# EAGLE design Base (EAGLE 9.6.2)
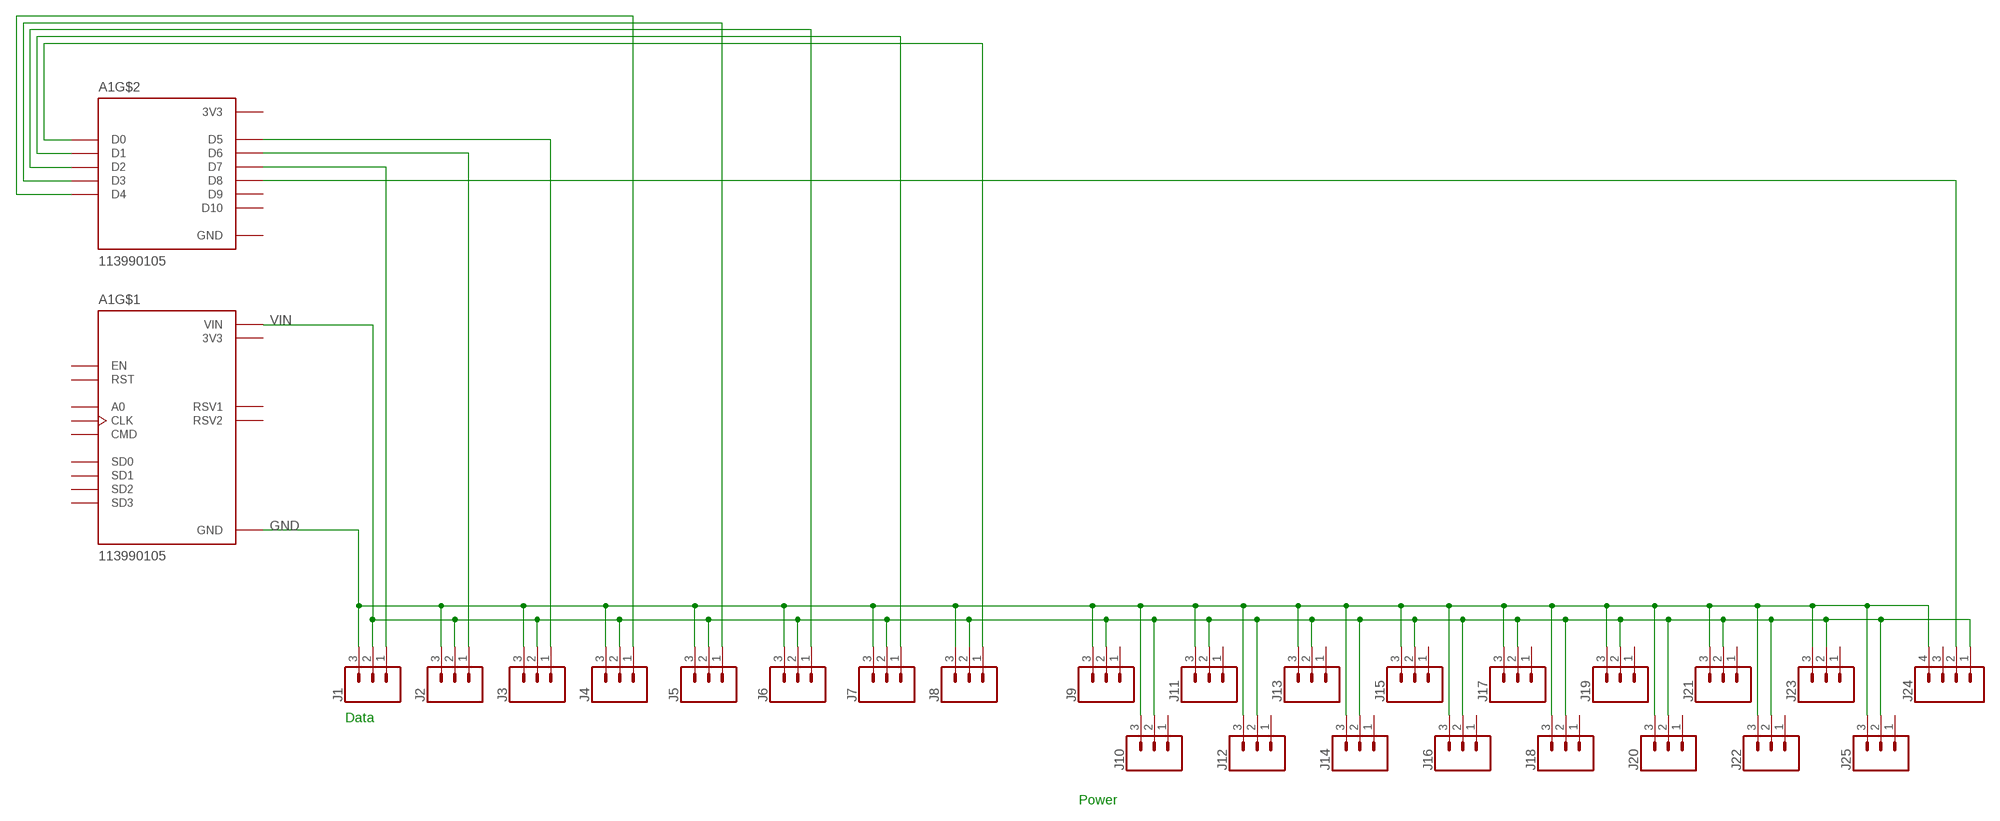
[diagram p0: schematic, sheet 1]

## Parts
A1  113990105  [SEEED_113990105]
J1  CONN_03  [1X03]
J2  CONN_03  [1X03]
J3  CONN_03  [1X03]
J4  CONN_03  [1X03]
J5  CONN_03  [1X03]
J6  CONN_03  [1X03]
J7  CONN_03  [1X03]
J8  CONN_03  [1X03]
J9  CONN_03  [1X03]
J10  CONN_03  [1X03]
J11  CONN_03  [1X03]
J12  CONN_03  [1X03]
J13  CONN_03  [1X03]
J14  CONN_03  [1X03]
J15  CONN_03  [1X03]
J16  CONN_03  [1X03]
J17  CONN_03  [1X03]
J18  CONN_03  [1X03]
J19  CONN_03  [1X03]
J20  CONN_03  [1X03]
J21  CONN_03  [1X03]
J22  CONN_03  [1X03]
J23  CONN_03  [1X03]
J24  CONN_04  [1X04]
J25  CONN_03  [1X03]

## Nets
GND: A1.J1_10(GND) A1.J1_14(GND) J1.3 J2.3 J3.3 J4.3 J5.3 J6.3 J7.3 J8.3 J9.3 J10.3 J11.3 J12.3 J13.3 J14.3 J15.3 J16.3 J17.3 J18.3 J19.3 J20.3 J21.3 J22.3 J23.3 J24.4 J25.3
N$1: A1.J2_10(D7) J1.1
N$2: A1.J2_9(D6) J2.1
N$3: A1.J2_8(D5) J3.1
N$4: A1.J2_5(D4) J4.1
N$5: A1.J2_4(D3) J5.1
N$6: A1.J2_3(D2) J6.1
N$7: A1.J2_2(D1) J7.1
N$8: A1.J2_1(D0) J8.1
N$11: A1.J2_11(D8) J24.2
VIN: A1.J1_15(VIN) J1.2 J2.2 J3.2 J4.2 J5.2 J6.2 J7.2 J8.2 J9.2 J10.2 J11.2 J12.2 J13.2 J14.2 J15.2 J16.2 J17.2 J18.2 J19.2 J20.2 J21.2 J22.2 J23.2 J24.1 J25.2
Unconnected: A1.J1_1(A0) A1.J1_2(RSV1) A1.J1_3(RSV2) A1.J1_4(SD3) A1.J1_5(SD2) A1.J1_6(SD1) A1.J1_7(CMD) A1.J1_8(SD0) A1.J1_9(CLK) A1.J1_12(EN) A1.J1_13(RST) A1.J2_12(D9) A1.J2_13(D10) J9.1 J10.1 J11.1 J12.1 J13.1 J14.1 J15.1 J16.1 J17.1 J18.1 J19.1 J20.1 J21.1 J22.1 J23.1 J24.3 J25.1

## Notes on the sheet
- Data
- Power

## Power pins joined to a net without a drawn wire
3V3: A1.J1_11(3V3) A1.J2_6(3V3) A1.J2_15(3V3)
GND: A1.J2_7(GND) A1.J2_14(GND)

## Library data of the parts
A1 = 113990105:113990105: NodeMCU v2 - Lua based ESP8266 development kit; AVAILABILITY: Unavailable; DESCRIPTION: An open-source firmware and development kit that helps you to Prototype your IOT product within a few Lua script lines; MF: Seeed Technology; MP: NodeMCU v2; PACKAGE: None; PRICE: None
J1-J23 J25 = SparkFun-Connectors:CONN_03: Multi connection point. Often used as Generic Header-pin footprint for 0.1 inch spaced/style header connections On any of the 0.1 inch spaced packages, you can populate with these: Break Away Headers - Straight <https://www.sparkfun.com/products/116> (PRT-00116) Break Away Male Headers - Right Angle <https://www.sparkfun.com/products/553> (PRT-00553) Female Headers <https://www.sparkfun.com/products/115> (PRT-00115) Break Away Headers - Machine Pin <https://www.sparkfun.com/products/117> (PRT-00117) Break Away Female Headers - Swiss Machine Pin <https://www.sparkfun.com/products/743> (PRT-00743) Stackable Header - 3 Pin (Female, 0.1") <https://www.sparkfun.com/products/13875> (PRT-13875) For SCREWTERMINALS and SPRING TERMINALS visit here: Screw Terimnals on SparkFun.com <https://www.sparkfun.com/search/results?term=Screw+Terminals> (5mm/3.5mm/2.54mm spacing) This device is also useful as a general connection point to wire up your design to another part of your project. Our various solder wires solder well into these plated through hole pads. Hook-Up Wire - Assortment (Stranded, 22 AWG) <https://www.sparkfun.com/products/11375> (PRT-11375) Hook-Up Wire - Assortment (Solid Core, 22 AWG) <https://www.sparkfun.com/products/11367> (PRT-11367) View the entire wire category on our website here <https://www.sparkfun.com/categories/141> Special notes: Molex polarized connector foot print use with SKU : PRT-08232 with associated crimp pins and housings.
J24 = SparkFun-Connectors:CONN_04: Multi connection point. Often used as Generic Header-pin footprint for 0.1 inch spaced/style header connections On any of the 0.1 inch spaced packages, you can populate with these: Break Away Headers - Straight <https://www.sparkfun.com/products/116> (PRT-00116) Break Away Male Headers - Right Angle <https://www.sparkfun.com/products/553> (PRT-00553) Female Headers <https://www.sparkfun.com/products/115> (PRT-00115) Break Away Headers - Machine Pin <https://www.sparkfun.com/products/117> (PRT-00117) Break Away Female Headers - Swiss Machine Pin <https://www.sparkfun.com/products/743> (PRT-00743) For SCREWTERMINALS and SPRING TERMINALS visit here: Screw Terimnals on SparkFun.com <https://www.sparkfun.com/search/results?term=Screw+Terminals> (5mm/3.5mm/2.54mm spacing) This device is also useful as a general connection point to wire up your design to another part of your project. Our various solder wires solder well into these plated through hole pads. Hook-Up Wire - Assortment (Stranded, 22 AWG) <https://www.sparkfun.com/products/11375> (PRT-11375) Hook-Up Wire - Assortment (Solid Core, 22 AWG) <https://www.sparkfun.com/products/11367> (PRT-11367) View the entire wire category on our website here <https://www.sparkfun.com/categories/141> Special notes: Molex polarized connector foot print use with SKU : PRT-08231 with associated crimp pins and housings. 1MM SMD Version SKU: PRT-10208; PROD_ID: CONN-09696

## Board
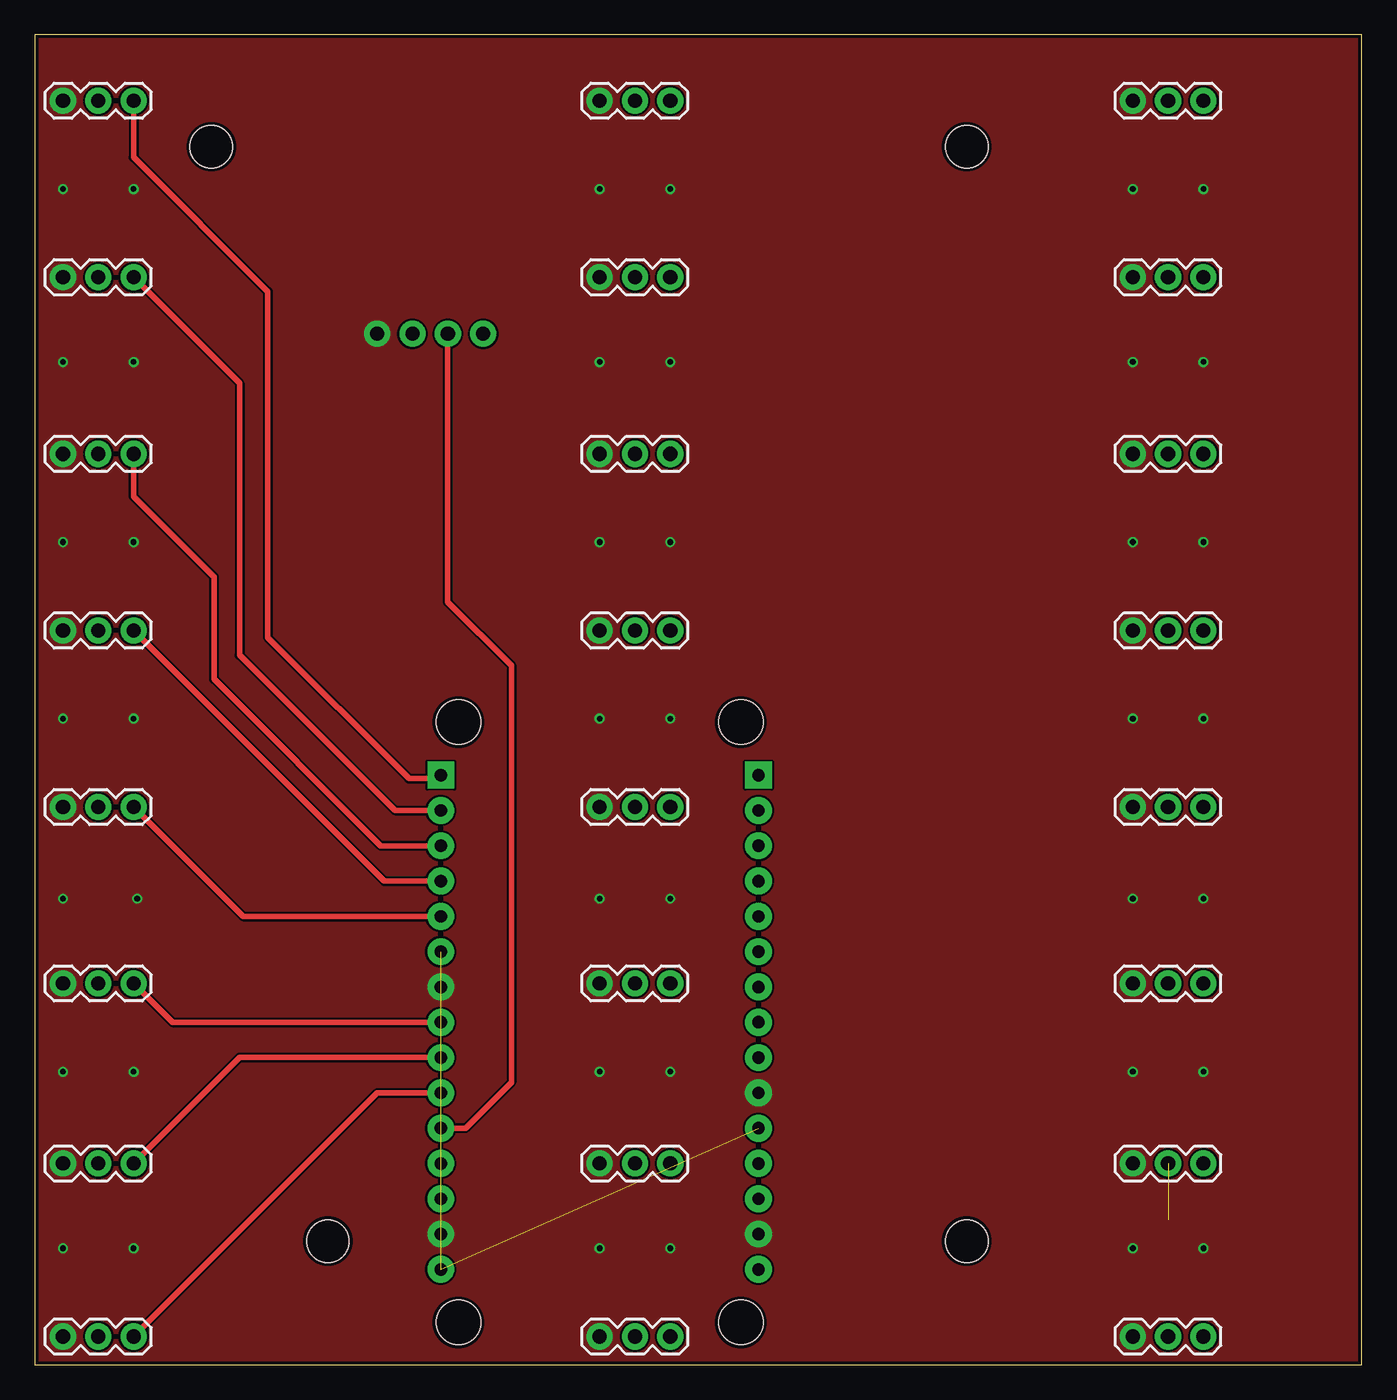
[diagram p1: board, top side]
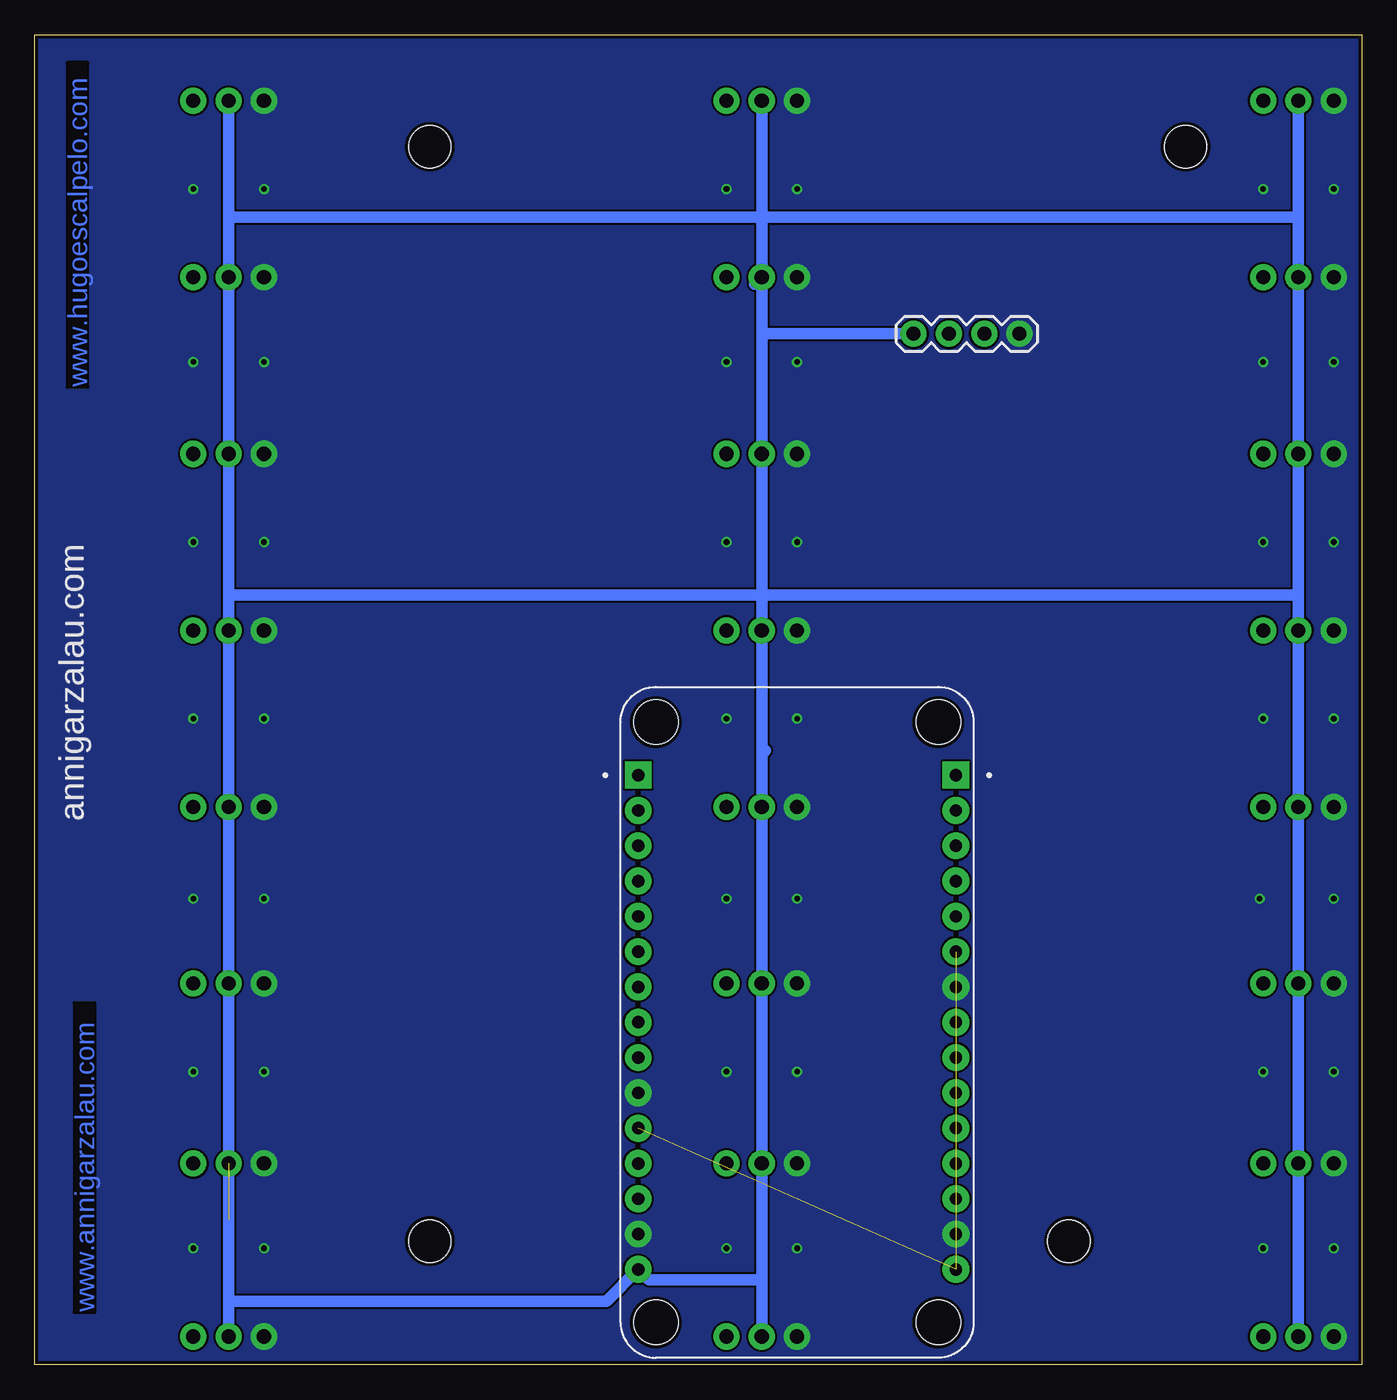
[diagram p2: board, bottom side, seen from below]

Size 95.48 x 95.68 mm. Coordinates in mm from the lower left corner, seen from the top.
Outline: 0,0 95.48,0 95.48,95.68 0,95.68 0,0
Copper layers (1*16): Top 0.035mm / dielectric 1.5mm / Bottom 0.035mm
Design rules "_xircuitos.mx_2L_DRC": minimum track width 6mil, minimum drill 12mil, track to track 6mil, track to pad 6mil, pad to pad 6mil, via to via 6mil, smd to smd 0mil, copper to edge 10mil, drill to drill 12mil, minimum pad ring 10mil, minimum via ring 6mil, stop-mask expansion 2mil, vias tented up to drill 100mil, thermal gap 10mil
Holes 3.05 mm at 12.7,87.63 67.06,87.63 21.08,8.89 67.06,8.89

### Footprints (pad centres in the part's own frame; a part is rotated, then mirrored left to right if it is on the bottom)
SEEED_113990105 = drill 0.889 pad 1.93 square: J1_1 -11.43,17.78; J2_1 11.43,17.78 | drill 0.889 pad 1.93: J1_2 -11.43,15.24; J1_3 -11.43,12.7; J1_4 -11.43,10.16; J1_5 -11.43,7.62; J1_6 -11.43,5.08; J1_7 -11.43,2.54; J1_8 -11.43,0; J1_9 -11.43,-2.54; J1_10 -11.43,-5.08; J1_11 -11.43,-7.62; J1_12 -11.43,-10.16; J1_13 -11.43,-12.7; J1_14 -11.43,-15.24; J1_15 -11.43,-17.78; J2_2 11.43,15.24; J2_3 11.43,12.7; J2_4 11.43,10.16; J2_5 11.43,7.62; J2_6 11.43,5.08; J2_7 11.43,2.54; J2_8 11.43,0; J2_9 11.43,-2.54; J2_10 11.43,-5.08; J2_11 11.43,-7.62; J2_12 11.43,-10.16; J2_13 11.43,-12.7; J2_14 11.43,-15.24; J2_15 11.43,-17.78 | hole 3.2: -10.16,21.59; 10.16,21.59; 10.16,-21.59; -10.16,-21.59
1X03 = drill 1.016 pad 1.88: 1 0,0; 2 2.54,0; 3 5.08,0
1X04 = drill 1.016 pad 1.88: 1 0,0; 2 2.54,0; 3 5.08,0; 4 7.62,0

### Placement (x,y rotation side)
A1  40.64,24.64 0 bottom
J1  7.11,2.03 180 top
J2  7.11,14.48 180 top
J3  7.11,27.43 180 top
J4  7.11,40.13 180 top
J5  7.11,52.83 180 top
J6  7.11,65.53 180 top
J7  7.11,78.23 180 top
J8  7.11,90.93 180 top
J9  45.72,2.03 180 top
J10  45.72,14.48 180 top
J11  45.72,27.43 180 top
J12  45.72,40.13 180 top
J13  45.72,52.83 180 top
J14  45.72,65.53 180 top
J15  45.72,78.23 180 top
J16  45.72,90.93 180 top
J17  84.07,2.03 180 top
J18  84.07,14.48 180 top
J19  84.07,27.43 180 top
J20  84.07,40.13 180 top
J21  84.07,52.83 180 top
J22  84.07,65.53 180 top
J23  84.07,78.23 180 top
J24  32.26,74.17 0 bottom
J25  84.07,90.93 180 top

### Tracks (layer width: path | path; a pad name or v marks a point on that pad's centre or on a via)
3V3  (2 unrouted)
GND  (via drill 0.41)
  other vias: 2.03,84.58 7.11,84.58 2.03,72.14 7.11,72.14 2.03,59.18 7.11,59.18 2.03,46.48 7.11,46.48 2.03,33.53 7.37,33.53 2.03,21.08 7.11,21.08 2.03,8.38 7.11,8.38 40.64,8.38 45.72,8.38 40.64,21.08 45.72,21.08 40.64,33.53 45.72,33.53 40.64,46.48 45.72,46.48 78.99,8.38 84.07,8.38 78.99,21.08 84.07,21.08 78.99,33.53 84.07,33.53 78.99,46.48 84.07,46.48 78.99,59.18 84.07,59.18 78.99,72.14 84.07,72.14 78.99,84.58 84.07,84.58 40.64,84.58 45.72,84.58 40.64,72.14 45.72,72.14 40.64,59.18 45.72,59.18
  pour Bottom (no thermals): 0,95.76 95.5,95.76 95.5,0 0,0
  pour Top (no thermals): 0,95.76 95.5,95.76 95.5,0 0,0
N$1
  Top 0.406: J1.1 24.64,19.56 A1.J2_10
N$2
  Top 0.406: J2.1 14.73,22.1 A1.J2_9
N$3
  Top 0.406: J3.1 9.91,24.64 A1.J2_8
N$4
  Top 0.406: J4.1 14.99,32.26 A1.J2_5
N$5
  Top 0.406: J5.1 25.15,34.8 A1.J2_4
N$6
  Top 0.406: A1.J2_3 24.89,37.34 12.9,49.33 12.9,56.68 7.11,62.47 J6.1
N$7
  Top 0.406: J7.1 14.73,70.61 14.73,51.05 25.91,39.88 A1.J2_2
N$8
  Top 0.406: J8.1 7.11,86.87 16.76,77.22 16.76,52.32 26.92,42.16 28.96,42.16 A1.J2_1
N$11
  Top 0.406: J24.2 29.72,54.86 34.29,50.29 34.29,20.32 30.99,17.02 A1.J2_11
VIN  (1 unrouted)
  Bottom 0.813: J8.2 4.57,82.55 | 4.57,82.55 J7.2 J6.2 4.57,55.37 | 4.57,55.37 J5.2 J4.2 J3.2 J2.2 J1.2 | J15.2 43.18,82.55 | J16.2 43.18,82.55 | 43.69,77.72 J15.2 | J15.2 43.18,73.91 | 43.18,73.91 J14.2 43.18,55.37 | 43.18,55.37 J13.2 43.18,43.94 | 43.18,43.94 J12.2 J11.2 J10.2 43.18,6.1 | 43.18,6.1 J9.2 | J25.2 81.53,82.55 | 81.53,82.55 J23.2 J22.2 81.53,55.12 | 81.53,55.12 J21.2 J20.2 J19.2 J18.2 81.53,4.57 54.36,4.57 A1.J1_15 51.31,6.1 43.18,6.1 | 81.53,10.41 J17.2 | 42.93,44.2 43.18,43.94 | 4.57,82.55 43.18,82.55 | 43.18,82.55 81.53,82.55 | 4.57,55.37 43.18,55.37 | 43.18,55.37 81.28,55.37 81.53,55.12 | J24.1 42.93,74.17 43.18,73.91

### Text on the board
Bottom: www.hugoescalpelo.com | www.annigarzalau.com
bNames: annigarzalau.com